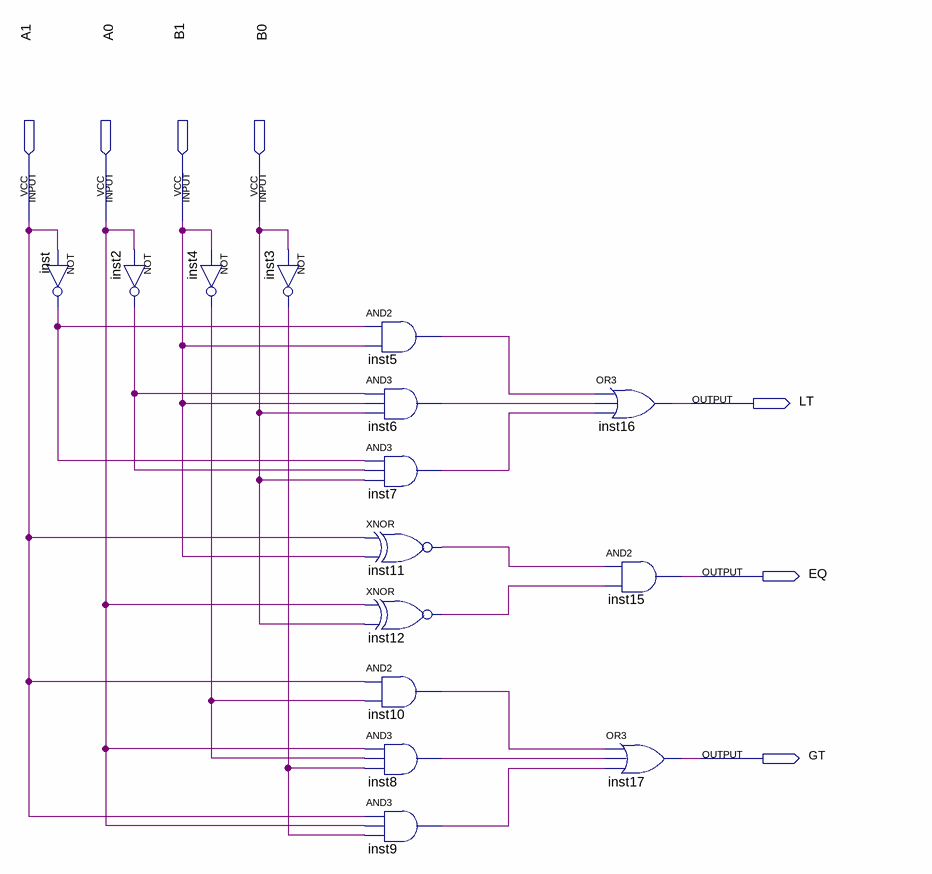
[diagram p0: schematic sheet]
// Quartus schematic twobitcomparator.bdf as structural Verilog: 15 symbols, 7 pins
module twobitcomparator (
  input  A1,
  input  A0,
  input  B1,
  input  B0,
  output LT,
  output EQ,
  output GT
);

  wire inst2_out, inst3_out, inst4_out, inst5_out, inst6_out, inst7_out, inst8_out, inst9_out, inst10_out,
       inst11_out, inst12_out, inst_out;

  not inst (inst_out, A1);
  not inst2 (inst2_out, A0);
  not inst4 (inst4_out, B1);
  not inst3 (inst3_out, B0);
  and inst5 (inst5_out, inst_out, B1);
  and inst6 (inst6_out, inst2_out, B1, B0);
  and inst7 (inst7_out, inst_out, inst2_out, B0);
  xnor inst11 (inst11_out, A1, B1);
  xnor inst12 (inst12_out, A0, B0);
  and inst10 (inst10_out, A1, inst4_out);
  and inst8 (inst8_out, A0, inst4_out, inst3_out);
  and inst9 (inst9_out, A1, A0, inst3_out);
  or inst16 (LT, inst5_out, inst6_out, inst7_out);
  and inst15 (EQ, inst11_out, inst12_out);
  or inst17 (GT, inst10_out, inst8_out, inst9_out);
endmodule
